# EAGLE design base (EAGLE 6.5.0)
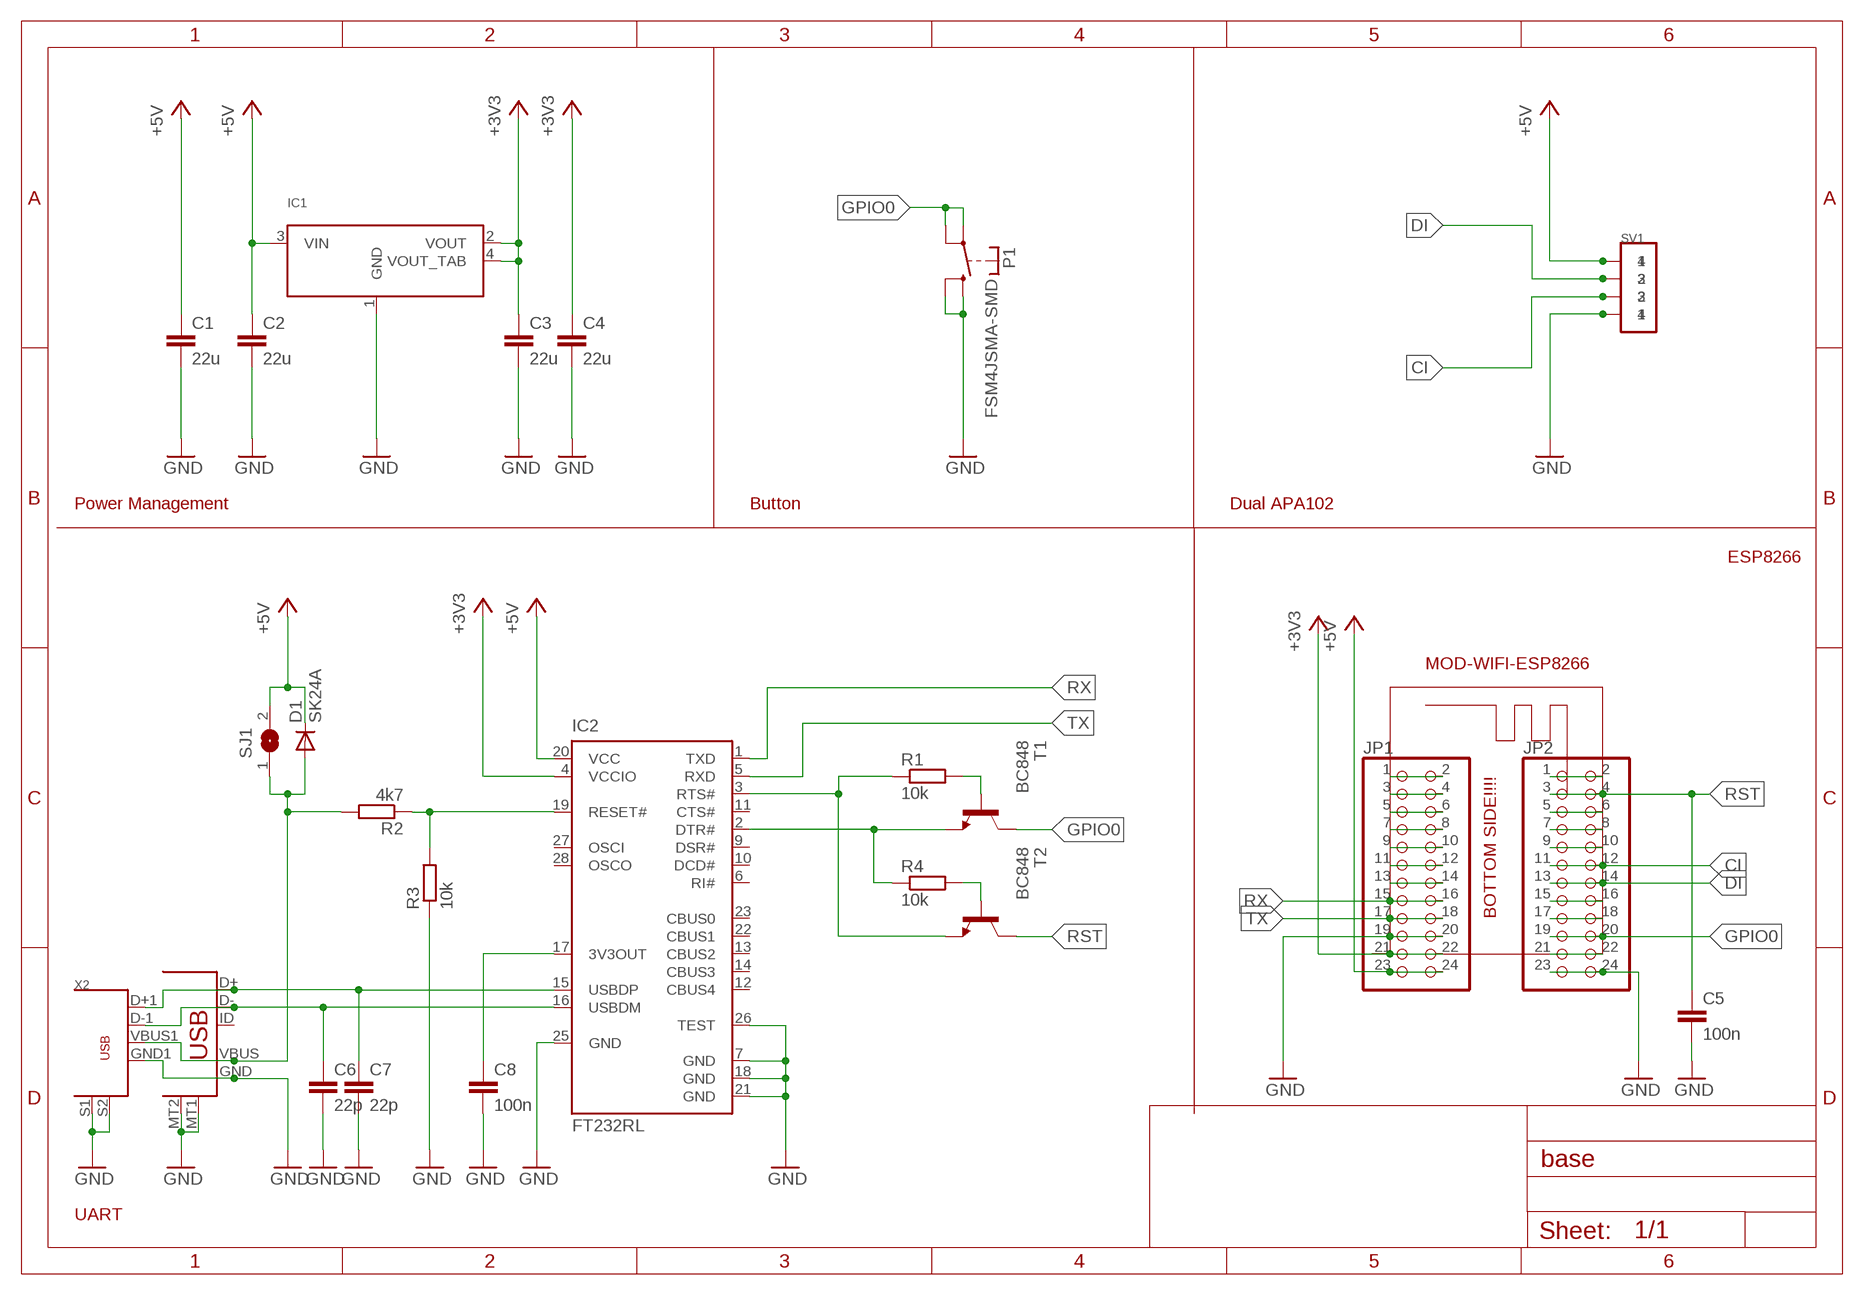
[diagram p0: schematic, sheet 1]

## Parts
C1  22u  C-EUC0805  [C0805]
C2  22u  C-EUC0805  [C0805]
C3  22u  C-EUC0805  [C0805]
C4  22u  C-EUC0805  [C0805]
C5  100n  C-EUC0603  [C0603]
C6  22p  C-EUC0603  [C0603]
C7  22p  C-EUC0603  [C0603]
C8  100n  C-EUC0603  [C0603]
D1  SK24A  DIODE-DO-214AC  [DO-214AC]
IC1  LM1117IMP  [SOT223]
IC2  FT232RL  [SSOP28]
JP1  PINHD-2X12_2.54  [2X12]
JP2  PINHD-2X12_2.54  [2X12]
P1  FSM4JSMA-SMD  [FSM4JSMA-SMD]
R1  10k  R-EU_R0603  [R0603]
R2  4k7  R-EU_R0603  [R0603]
R3  10k  R-EU_R0603  [R0603]
R4  10k  R-EU_R0603  [R0603]
SJ1  SJ  [SJ]
SV1  1X4SMD-2.54  [1X4SMD-2.54]
SV2  1X4SMD-2.54  [1X4SMD-2.54]
T1  BC848  [SOT23]
T2  BC848  [SOT23]
X1  USB-B  [USB-MICROB]
X2  USB-MALE-SMT  [USB-MALE-SMT]

## Nets
+3V3: C3.1 C4.1 IC1.2(VOUT) IC1.4(VOUT_TAB) IC2.4(VCCIO) JP1.21 JP1.22
+5V [pwr]: C1.1 C2.1 D1.C IC1.3(VIN) IC2.20(VCC) JP1.23 JP1.24 SJ1.2 SV1.1 SV2.4
CI: JP2.11 JP2.12 SV1.3 SV2.2
DI: JP2.13 JP2.14 SV1.2 SV2.3
GND [pwr]: C1.2 C2.2 C3.2 C4.2 C5.2 C6.2 C7.2 C8.2 IC1.1(GND) IC2.7(GND) IC2.18(GND) IC2.21(GND) IC2.25(GND) IC2.26(TEST) JP1.19 JP1.20 JP2.23 JP2.24 P1.P$3(S) P1.P$4(S) R3.1 SV1.4 SV2.1 X1.GND X1.MT1 X1.MT2 X2.GND1(GND) X2.S1 X2.S2
GPIO0: JP2.19 JP2.20 P1.P$1(P) P1.P$2(P) T1.3(C)
N$1: IC2.3(RTS#) R1.1 T2.2(E)
N$2: D1.A R2.2 SJ1.1 X1.VBUS X2.VBUS1(VBUS)
N$3: C7.1 IC2.15(USBDP) X1.D+ X2.D+1(D+)
N$4: C6.1 IC2.16(USBDM) X1.D- X2.D-1(D-)
N$5: IC2.2(DTR#) R4.1 T1.2(E)
N$6: IC2.19(RESET#) R2.1 R3.2
N$7: R1.2 T1.1(B)
N$8: R4.2 T2.1(B)
N$11: JP1.3 JP1.4
N$12: C8.1 IC2.17(3V3OUT)
N$13: JP1.5 JP1.6
N$14: JP1.7 JP1.8
N$15: JP1.9 JP1.10
N$16: JP1.11 JP1.12
N$17: JP1.13 JP1.14
N$18: JP2.1 JP2.2
N$19: JP2.5 JP2.6
N$20: JP2.7 JP2.8
N$21: JP2.9 JP2.10
N$22: JP2.15 JP2.16
N$23: JP2.17 JP2.18
RST: C5.1 JP2.3 JP2.4 T2.3(C)
RX: IC2.1(TXD) JP1.15 JP1.16
SSL: JP2.21 JP2.22
SSR: JP1.1 JP1.2
TX: IC2.5(RXD) JP1.17 JP1.18
Unconnected: IC2.6(RI#) IC2.9(DSR#) IC2.10(DCD#) IC2.11(CTS#) IC2.12(CBUS4) IC2.13(CBUS2) IC2.14(CBUS3) IC2.22(CBUS1) IC2.23(CBUS0) IC2.27(OSCI) IC2.28(OSCO) X1.ID

## Notes on the sheet
- Power Management | Button | Dual APA102
- ESP8266
- MOD-WIFI-ESP8266
- BOTTOM SIDE!!!!
- UART

## Library data of the parts
C1-C4 = rcl-2:C-EU: CAPACITOR, European symbol
C5-C8 = rcl:C-EU: CAPACITOR, European symbol
D1 = diode:DIODE-: DIODE
IC1 = sid:LM1117IMP
IC2 = ftdichip:FT232R: Source: http://www.ftdichip.com/Documents/DataSheets/DS_FT232R_v104.pdf
JP1 JP2 = pinhead-2:PINHD-2X12: PIN HEADER
P1 = switch-misc:FSM4JSMA-SMD: TYCO SWITCH
R1-R4 = rcl-2:R-EU_: RESISTOR, European symbol
SJ1 = jumper:SJ: SMD solder JUMPER
SV1 SV2 = sid:1X4SMD-2.54
T1 T2 = transistor-neu-to92:BC848: NPN TRANSISTOR
X1 = sid:USB-B
X2 = sid:USB-MALE-SMT

## Net classes
1 pwr: width 0.152 mm, drill 0.305 mm, clearance 0.152 mm

## Board
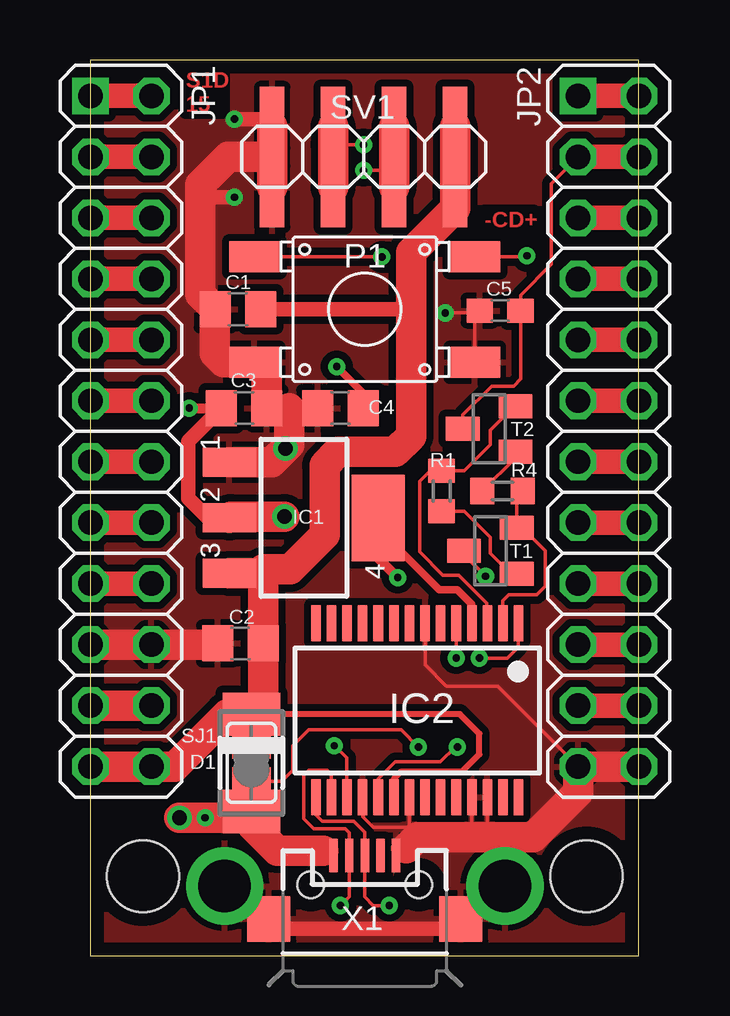
[diagram p1: board, top side]
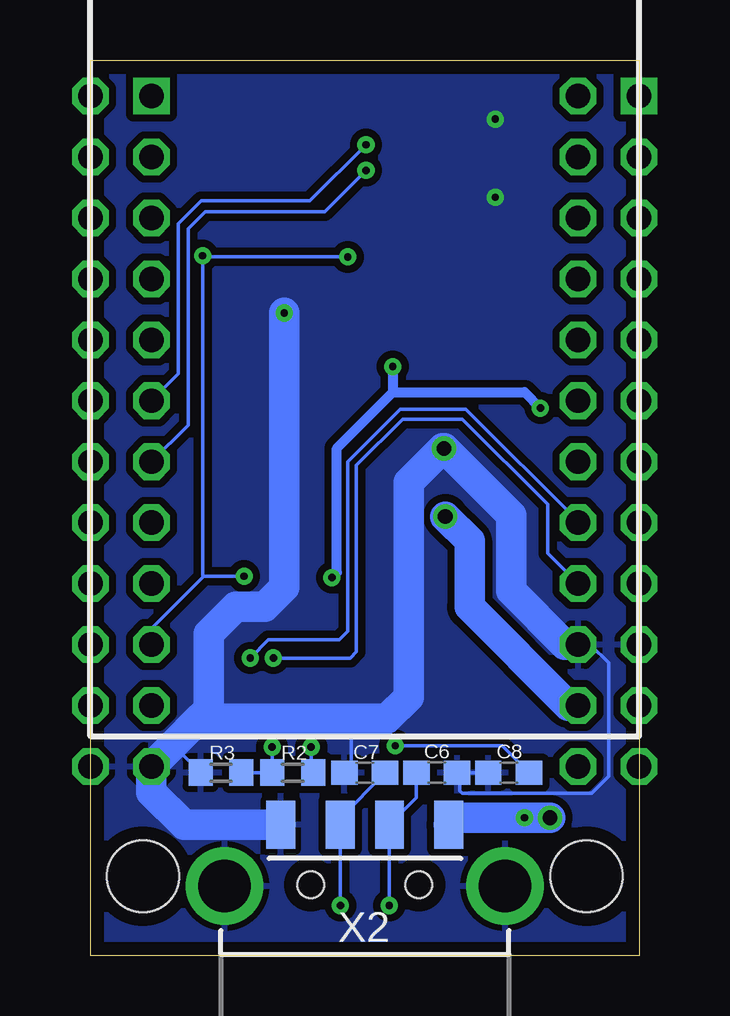
[diagram p2: board, bottom side, seen from below]

Size 22.84 x 37.31 mm. Coordinates in mm from the lower left corner, seen from the top.
Outline: 0,0 22.84,0 22.84,37.31 0,37.31 0,0
Copper layers (1*16): Top 0.035mm / dielectric 1.5mm / Bottom 0.035mm
Design rules "default *": minimum track width 6mil, minimum drill 12mil, track to track 6mil, track to pad 6mil, pad to pad 6mil, via to via 6mil, smd to smd 6mil, copper to edge 22mil, drill to drill 8mil, minimum pad ring 10mil, minimum via ring 8mil, stop-mask expansion 4mil, vias tented up to drill 25mil, thermal gap 10mil
Holes 3 mm at 2.18,3.3 20.68,3.3

### Footprints (pad centres in the part's own frame; a part is rotated, then mirrored left to right if it is on the bottom)
C0805 = smd 1.3 x 1.5: 1 -0.95,0; 2 0.95,0
C0603 = smd 1.1 x 1: 1 -0.85,0; 2 0.85,0
DO-214AC = smd 1.8 x 2.4: A 2.025,0; C -2.025,0
SOT223 = smd 1.219 x 2.235: 1 -2.311,-3.099; 2 0,-3.099; 3 2.311,-3.099 | smd 3.6 x 2.2: 4 0,3.099
SSOP28 = smd 0.4 x 1.5: 1 -4.225,-3.625; 2 -3.575,-3.625; 3 -2.925,-3.625; 4 -2.275,-3.625; 5 -1.625,-3.625; 6 -0.975,-3.625; 7 -0.325,-3.625; 8 0.325,-3.625; 9 0.975,-3.625; 10 1.625,-3.625; 11 2.275,-3.625; 12 2.925,-3.625; 13 3.575,-3.625; 14 4.225,-3.625; 15 4.225,3.625; 16 3.575,3.625; 17 2.925,3.625; 18 2.275,3.625; 19 1.625,3.625; 20 0.975,3.625; 21 0.325,3.625; 22 -0.325,3.625; 23 -0.975,3.625; 24 -1.625,3.625; 25 -2.275,3.625; 26 -2.925,3.625; 27 -3.575,3.625; 28 -4.225,3.625
2X12 = drill 1.016 square: 1 -13.97,-1.27 | drill 1.016 octagon: 2 -13.97,1.27; 3 -11.43,-1.27; 4 -11.43,1.27; 5 -8.89,-1.27; 6 -8.89,1.27; 7 -6.35,-1.27; 8 -6.35,1.27; 9 -3.81,-1.27; 10 -3.81,1.27; 11 -1.27,-1.27; 12 -1.27,1.27; 13 1.27,-1.27; 14 1.27,1.27; 15 3.81,-1.27; 16 3.81,1.27; 17 6.35,-1.27; 18 6.35,1.27; 19 8.89,-1.27; 20 8.89,1.27; 21 11.43,-1.27; 22 11.43,1.27; 23 13.97,-1.27; 24 13.97,1.27
FSM4JSMA-SMD = smd 1.3 x 2.1: P$1 -2.196,4.584; P$2 -2.196,-4.6; P$3 2.204,4.584; P$4 2.204,-4.6
R0603 = smd 1 x 1.1: 1 -0.85,0; 2 0.85,0
SJ = smd 1.168 x 1.6: 1 -0.762,0; 2 0.762,0
1X4SMD-2.54 = smd 1.016 x 3.302: 1 -3.81,1.27; 2 -1.27,1.27; 3 1.27,1.27; 4 3.81,1.27
SOT23 = smd 1 x 1.4: 1 -0.95,-1.1; 2 0.95,-1.1; 3 0,1.1
USB-MICROB = smd 0.35 x 1.4: D+ 0,2.65; D- -0.65,2.65; GND 1.3,2.65; ID 0.65,2.65; VBUS -1.3,2.65 | smd 1.8 x 1.9: MT1 -4,0; MT2 4,0
USB-MALE-SMT = smd 1.2 x 2: D+1 1.027,-6.21; D-1 -1.027,-6.21; GND1 3.5,-6.21; VBUS1 -3.5,-6.21 | drill 2.2: S1 -5.842,-3.658; S2 5.842,-3.658 | hole 1.1: 2.25,-3.71; -2.25,-3.71

### Placement (x,y rotation side)
C1  6.15,26.92 180 top
C2  6.25,13 180 top
C3  6.4,22.81 0 top
C4  10.41,22.81 180 top
C5  17.07,26.87 180 top
C6  8.43,7.62 0 bottom
C7  11.43,7.62 180 bottom
C8  5.44,7.62 180 bottom
D1  6.71,8.03 270 top
IC1  8.89,18.24 270 top
IC2  13.61,10.21 180 top
JP1  1.27,21.84 270 top
JP2  21.59,21.84 270 top
P1  11.43,26.92 270 top
R1  14.63,19.35 270 top
R2  14.43,7.62 0 bottom
R3  17.42,7.62 0 bottom
R4  17.17,19.35 180 top
SJ1  6.71,8.03 90 top
SV1  11.38,33.27 180 top
SV2  11.38,33.27 0 top
T1  16.66,16.87 90 top
T2  16.61,21.95 90 top
X1  11.43,1.52 0 top
X2  11.43,-0.76 180 bottom

### Tracks (layer width: path | path; a pad name or v marks a point on that pad's centre or on a via)
+3V3  (via drill 0.3, 0.61)
  Top 0.305: IC2.4 15.89,14.64 15.29,15.24 14.53,15.24 12.55,17.22 12.55,17.68 IC1.4 | C4.1 11.36,23.43 v10.26,24.54
  Top 0.406: IC1.4 11.99,16.56 v12.8,15.75 | v4.11,22.81 C3.1
  Top 0.61: C3.1 4.06,21.42 4.06,19.05 4.88,18.24 IC1.2
  Top 1.27: JP1.21 JP1.22 | IC1.2 5.84,18.29 v8.08,18.29
  Bottom 0.406: v12.8,15.75 12.6,15.95 12.6,21.13 10.26,23.47 | v10.26,24.54 10.26,23.47 | 10.26,23.47 4.77,23.47 v4.11,22.81
  Bottom 1.27: v8.08,18.29 7.06,17.27 7.06,14.53 2.95,10.41 JP1.22
+5V
  Top 0.152: D1.C SJ1.2
  Top 0.254: IC2.20 12.64,7.36 12.95,7.67 15.49,7.67 16.2,8.38 16.2,9.25 15.39,10.06 7.7,10.06 7.2,10.56
  Top 0.61: C1.1 13.26,26.92 13.36,26.82
  Top 1.27: JP1.23 JP1.24 3.5,7.87 5.69,10.06 D1.C | D1.C | D1.C 7.2,10.56 C2.1 7.2,16.09 | SV2.4 SV1.1 15.19,31.14 13.36,29.31 13.36,26.82 13.36,21.64 12.7,20.98 10.31,20.98 9.75,20.42 9.75,17.53 8.32,16.09 7.2,16.09 | IC1.3 7.04,15.93 7.2,16.09
CI  (via drill 0.3)
  Top 0.152: v11.38,33.78 10.11,33.78
  Top 1.016: JP2.11 JP2.12
  Top 1.27: SV2.2 10.11,33.78 SV1.3
  Bottom 0.152: JP2.11 19.2,24.23 19.2,30.48 18.24,31.45 13.72,31.45 v11.38,33.78
DI  (via drill 0.3)
  Top 0.152: v11.38,32.72 12.65,32.72
  Top 1.016: JP2.13 JP2.14
  Top 1.27: SV2.3 12.65,32.72 SV1.2
  Bottom 0.152: JP2.13 18.8,22.1 18.8,30.28 18.08,30.99 13.11,30.99 v11.38,32.72
GND  (via drill 0.3, 0.61)
  Top 0.152: IC2.25 15.89,4.93 15.8,4.93 | IC2.26 16.54,4.93 16.51,4.93 | 17.22,4.93 17.27,4.88 X2.S2 15.9,1.52 X1.MT2 15.02,1.12 | 7.84,1.12 X1.MT1 6.96,1.52 X2.S1 | IC2.21 13.29,5.25 | 13.29,5.25 13.61,4.93 | IC2.18 11.34,5.78 11.79,5.33 13.21,5.33 13.29,5.25 | C5.2 16.02,26.91 P1.P$3 16.01,26.77 v14.78,26.77 | IC2.7 13.94,12.12 14.83,11.23 16.97,11.23 JP2.23
  Top 0.305: X1.GND 13.03,4.47 13.16,4.47
  Top 0.61: C3.2 8.28,22.81 C4.2 | 7.84,1.12 15.02,1.12 | v5.99,34.85 7.26,34.85 SV2.1 | v5.99,31.6 4.83,31.6 4.57,31.34
  Top 1.27: SV2.1 7.57,33.33 | 7.57,33.33 SV1.4 | JP1.19 JP1.20 5.15,12.95 C2.2 | IC1.1 7.54,20.55 v8.13,21.13 8.28,21.29 8.28,22.81 | 13.16,4.47 13.61,4.93 15.8,4.93 16.51,4.93 17.22,4.93 18.44,4.93 20.32,6.81 JP2.23 JP2.24 | C3.2 7.35,24.2 P1.P$4 5.56,24.72 5.18,25.1 5.18,26.91 C1.2 4.57,27.55 4.57,31.34 4.57,32.11 5.74,33.27 7.52,33.27 7.57,33.33
  Bottom 0.152: 9.82,9.86 10.52,9.86 | C7.2 11.99,7.66 11.99,9.86 | R3.1 19.41,8.75 19.41,8.79 | C8.2 C6.2 7.47,7.51 7.47,6.86 7.37,6.76 1.98,6.76 1.27,7.47 1.27,12.19 2.03,12.95 JP1.20
  Bottom 1.27: JP1.20 3.1,12.95 5.33,15.19 5.33,18.34 v8.13,21.13 8.18,21.13 9.6,19.71 9.6,10.77 10.52,9.86 11.99,9.86 18.34,9.86 19.41,8.79 JP2.23 | X2.GND1 18.96,5.45 20.32,6.81 JP2.23 | v14.78,26.77 14.78,15.34 15.6,14.53 16.81,14.53 17.93,13.41 17.93,10.26 JP2.23
  pour Top (isolate 0.305): 0.05,37.08 22.66,37.08 22.66,0.25 0.05,0.25
  pour Bottom (isolate 0.305): 0.05,37.08 22.66,37.08 22.66,0.25 0.05,0.25
GPIO0  (via drill 0.3)
  Top 0.152: T1.3 15.56,16.7 v16.46,15.8 | P1.P$1 18.15,29.12 v18.19,29.16 | P1.P$2 12.13,29.12 v12.14,29.11
  Top 1.016: JP2.19 JP2.20
  Bottom 0.152: v16.46,15.8 18.14,15.8 | 18.14,15.8 20.32,13.61 JP2.19 | 18.14,15.8 18.19,15.85 v18.19,29.16 18.14,29.11 v12.14,29.11
N$1
  Top 0.152: T2.2 17.66,22.9 16.66,21.9 16.66,21.29 15.58,20.21 R1.1 14.16,20.21 13.72,19.76 13.72,16.82 14.68,15.85 15.34,15.85 16.51,14.68 16.51,13.87 IC2.3
N$2  (via drill 0.3, 0.61)
  Top 0.152: X1.VBUS 10.09,4.22 9.96,4.22 | v13.66,8.69 12.95,9.4 9.09,9.4 8.43,8.74 8.43,7.72 7.98,7.26 SJ1.1 D1.A
  Top 0.61: 9.96,4.22 9.7,4.37
  Top 1.27: 9.7,4.37 7.77,4.37 6.76,5.39 D1.A 6.44,5.74 v4.77,5.74 v3.71,5.74
  Bottom 0.152: R2.2 13.66,7.71 v13.66,8.69
  Bottom 1.27: X2.VBUS1 7.64,5.74 v4.77,5.74 v3.71,5.74
N$3  (via drill 0.3)
  Top 0.152: IC2.15 9.4,6.48 9.4,5.84 9.65,5.59 10.97,5.59 11.43,5.13 X1.D+ 11.43,2.44 11.79,2.08 v12.45,2.08
  Bottom 0.152: v12.45,2.08 v12.46,2.09 X2.D+1 12.46,5.73 C7.1
N$4  (via drill 0.3)
  Top 0.152: IC2.16 10.04,7.54 9.85,7.72 9.09,7.72 8.89,7.52 8.89,5.69 9.3,5.28 10.62,5.28 10.78,5.12 X1.D- 10.78,2.45 v10.41,2.08
  Bottom 0.152: v10.41,2.08 v10.4,2.09 X2.D-1 9.28,6.57 C6.1
N$5
  Top 0.152: R4.1 17.76,19.1 T1.2 18,17.82 18.95,16.87 18.95,15.39 18.59,15.04 17.42,15.04 17.17,14.78 17.17,13.86 IC2.2
N$6  (via drill 0.3)
  Top 0.152: IC2.19 11.99,7.37 12.7,8.08 14.58,8.08 15.19,8.69 v15.29,8.69
  Bottom 0.152: R3.2 R2.1 15.28,8.72 v15.29,8.69
N$7
  Top 0.152: R1.2 15.58,18.51 16.66,17.42 16.66,16.76 17.51,15.92 T1.1
N$8
  Top 0.152: R4.2 17.71,20.75 T2.1
N$11
  Top 1.016: JP1.3 JP1.4
N$12  (via drill 0.3)
  Top 0.152: IC2.17 10.67,6.61 10.67,8.23 v10.16,8.74
  Bottom 0.152: C8.1 5.7,8.74 v10.16,8.74
N$13
  Top 1.016: JP1.5 JP1.6
N$14
  Top 1.016: JP1.7 JP1.8
N$15
  Top 1.016: JP1.9 JP1.10
N$16
  Top 1.016: JP1.11 JP1.12
N$17
  Top 1.016: JP1.13 JP1.14
N$18
  Top 1.016: JP2.1 JP2.2
N$19
  Top 1.016: JP2.5 JP2.6
N$20
  Top 1.016: JP2.7 JP2.8
N$21
  Top 1.016: JP2.9 JP2.10
N$22
  Top 1.016: JP2.15 JP2.16
N$23
  Top 1.016: JP2.17 JP2.18
RST
  Top 0.152: T2.3 15.51,22.52 16.71,23.72 17.63,23.72 17.93,24.03 17.93,26.86 C5.1 17.92,27.52 19.2,28.8 19.2,32.16 JP2.3
  Top 1.016: JP2.3 JP2.4
RX  (via drill 0.3)
  Top 0.152: v16.2,12.4 17.37,12.4 17.83,12.85 IC2.1
  Top 1.016: JP1.15 JP1.16
  Bottom 0.152: JP1.16 2.54,18.09 7.21,22.76 9.96,22.76 12.14,20.57 12.14,13.51 12.5,13.16 15.44,13.16 v16.2,12.4
SSL
  Top 1.016: JP2.21 JP2.22
SSR
  Top 1.016: JP1.1 JP1.2
TX  (via drill 0.3)
  Top 0.152: v15.24,12.4 IC2.5
  Top 1.016: JP1.17 JP1.18
  Bottom 0.152: JP1.18 3.81,16.76 3.81,18.8 7.37,22.35 9.85,22.35 11.79,20.42 11.79,12.65 12.04,12.4 v15.24,12.4

### Text on the board
Top: S1D / 15 | -CD+